# Altium schematic sheet WiFiNode_Pwr_R00.SchDoc: Nodo WiFi
size A4; Author: Hernan M. Travado; Revision: 0; SheetNumber: 2; SheetTotal: 5
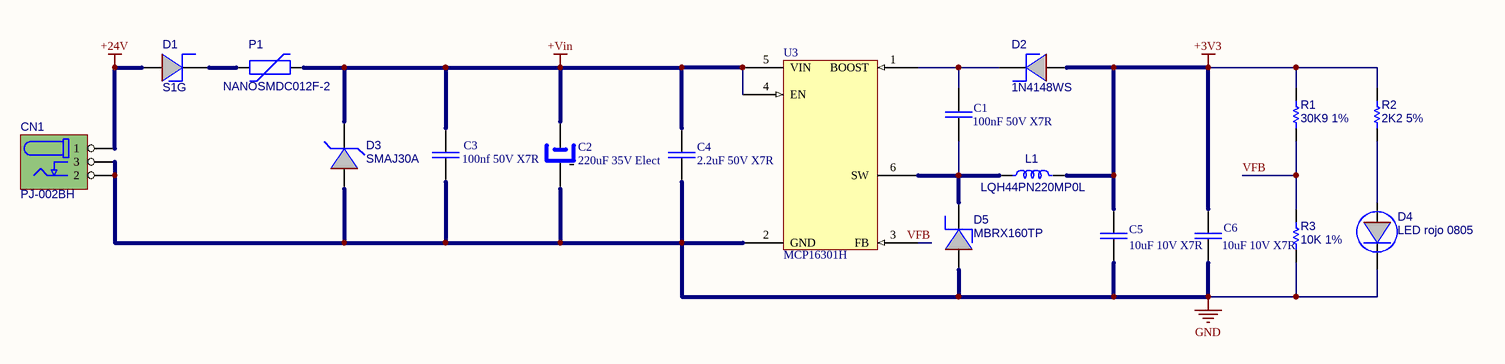
[diagram p0: WiFiNode_Pwr_R00.SchDoc]

## Parts
C1  100nF 50V X7R  [C_0805]
C2  220uF 35V Elect  [C_RAD_0.135_H_8X12_S]
C3  100nf 50V X7R  [C_0805]
C4  2.2uF 50V X7R  [C_0805]
C5  10uF 10V X7R  [C_0805]
C6  10uF 10V X7R  [C_0805]
CN1  PJ-002BH  [PJ002B]
D1  S1G  [D_SMA]
D2  1N4148WS  [SOD_323]
D3  SMAJ30A  [D_SMA]
D4  LED rojo 0805  [D_0805]
D5  MBRX160TP  [SOD_123]
L1  LQH44PN220MP0L  [LQH44]
P1  NANOSMDC012F-2  [NANOSMDC]
R1  30K9 1%  [R_0805]
R2  2K2 5%  [R_0805]
R3  10K 1%  [R_0805]
U3  MCP16301H  [SOT23-6]

## Nets
+3V3: C5.1 C6.1 D2.1(A) L1.2 R1.2 R2.2
+24V: CN1.1 D1.1(A)
+Vin: C2.1 C3.1 C4.1 D3.2(K) P1.2 U3.4(EN) U3.5(VIN)
GND: C2.2 C3.2 C4.2 C5.2 C6.2 CN1.2 CN1.3 D3.1(A) D4.2(K) D5.1(A) R3.1 U3.2(GND)
VFB: R1.1 R3.2 U3.3(FB)
NetC1_1: C1.1 D2.2(K) U3.1(BOOST)
NetC1_2: C1.2 D5.2(K) L1.1 U3.6(SW)
NetD1_2: D1.2(K) P1.1
NetD4_1: D4.1(A) R2.1

## Notes on the sheet
- Title:
- Size:
- Author:
- A4
- Sheet
- of
- Revision:
- File:
- Date:

## Library data of the parts
C1 C3-C6 = Ceramic capacitor
C2 = Pol capacitor: Polarized Capacitor
CN1 = CN_PowerJack: Barrel Power Connector
D1 D2 D5 = DIODO_SH: Diode Shottky
D3 = DIODE_TVS: Unidirectional TVS
D4 = LED
L1 = IND: Inductor
P1 = PLYSW: Polyswitch
R1-R3 = Res1: Resistor
U3 = MCP16301: Sted down switching